# EAGLE design RP2040_Minimal (EAGLE 9.6.2)
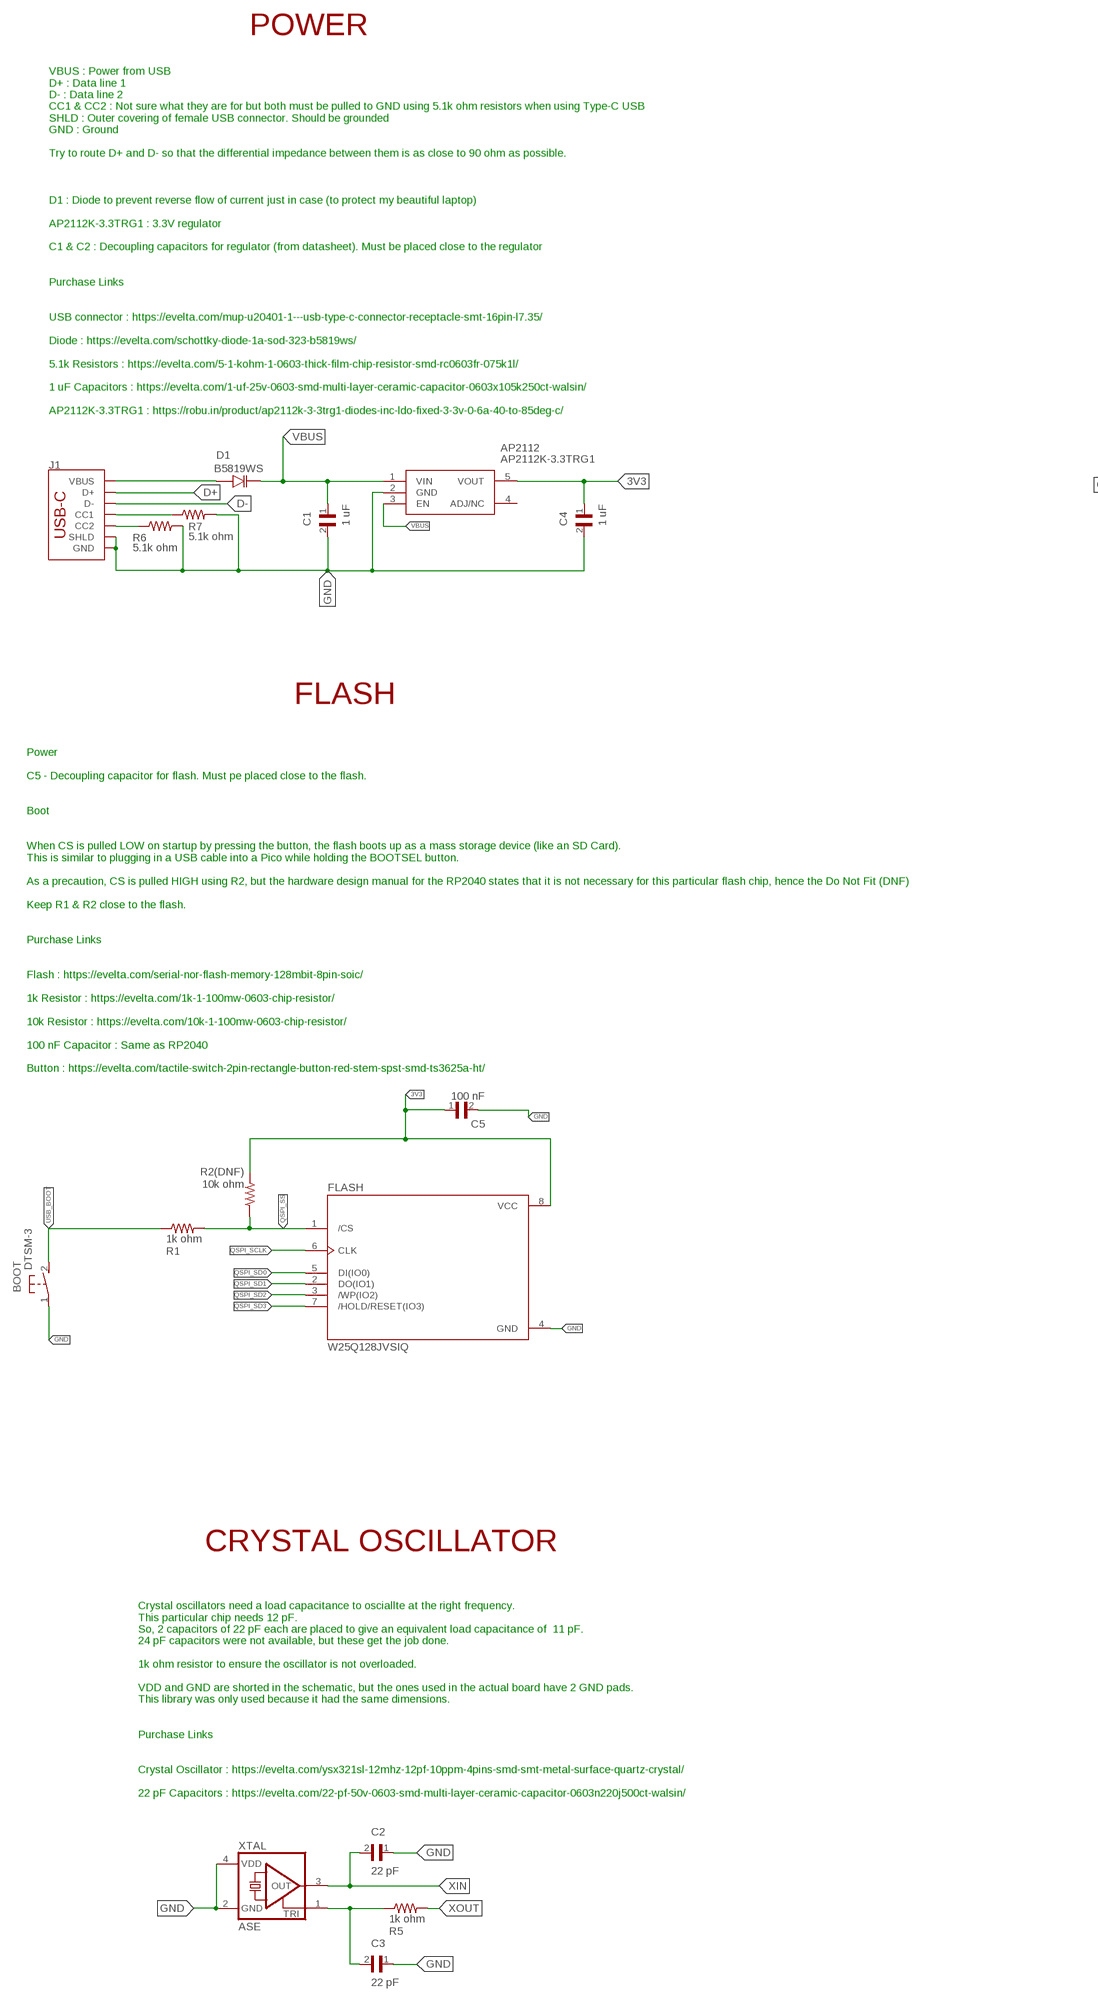
[diagram p0: schematic, sheet 1, part 1 of 2]
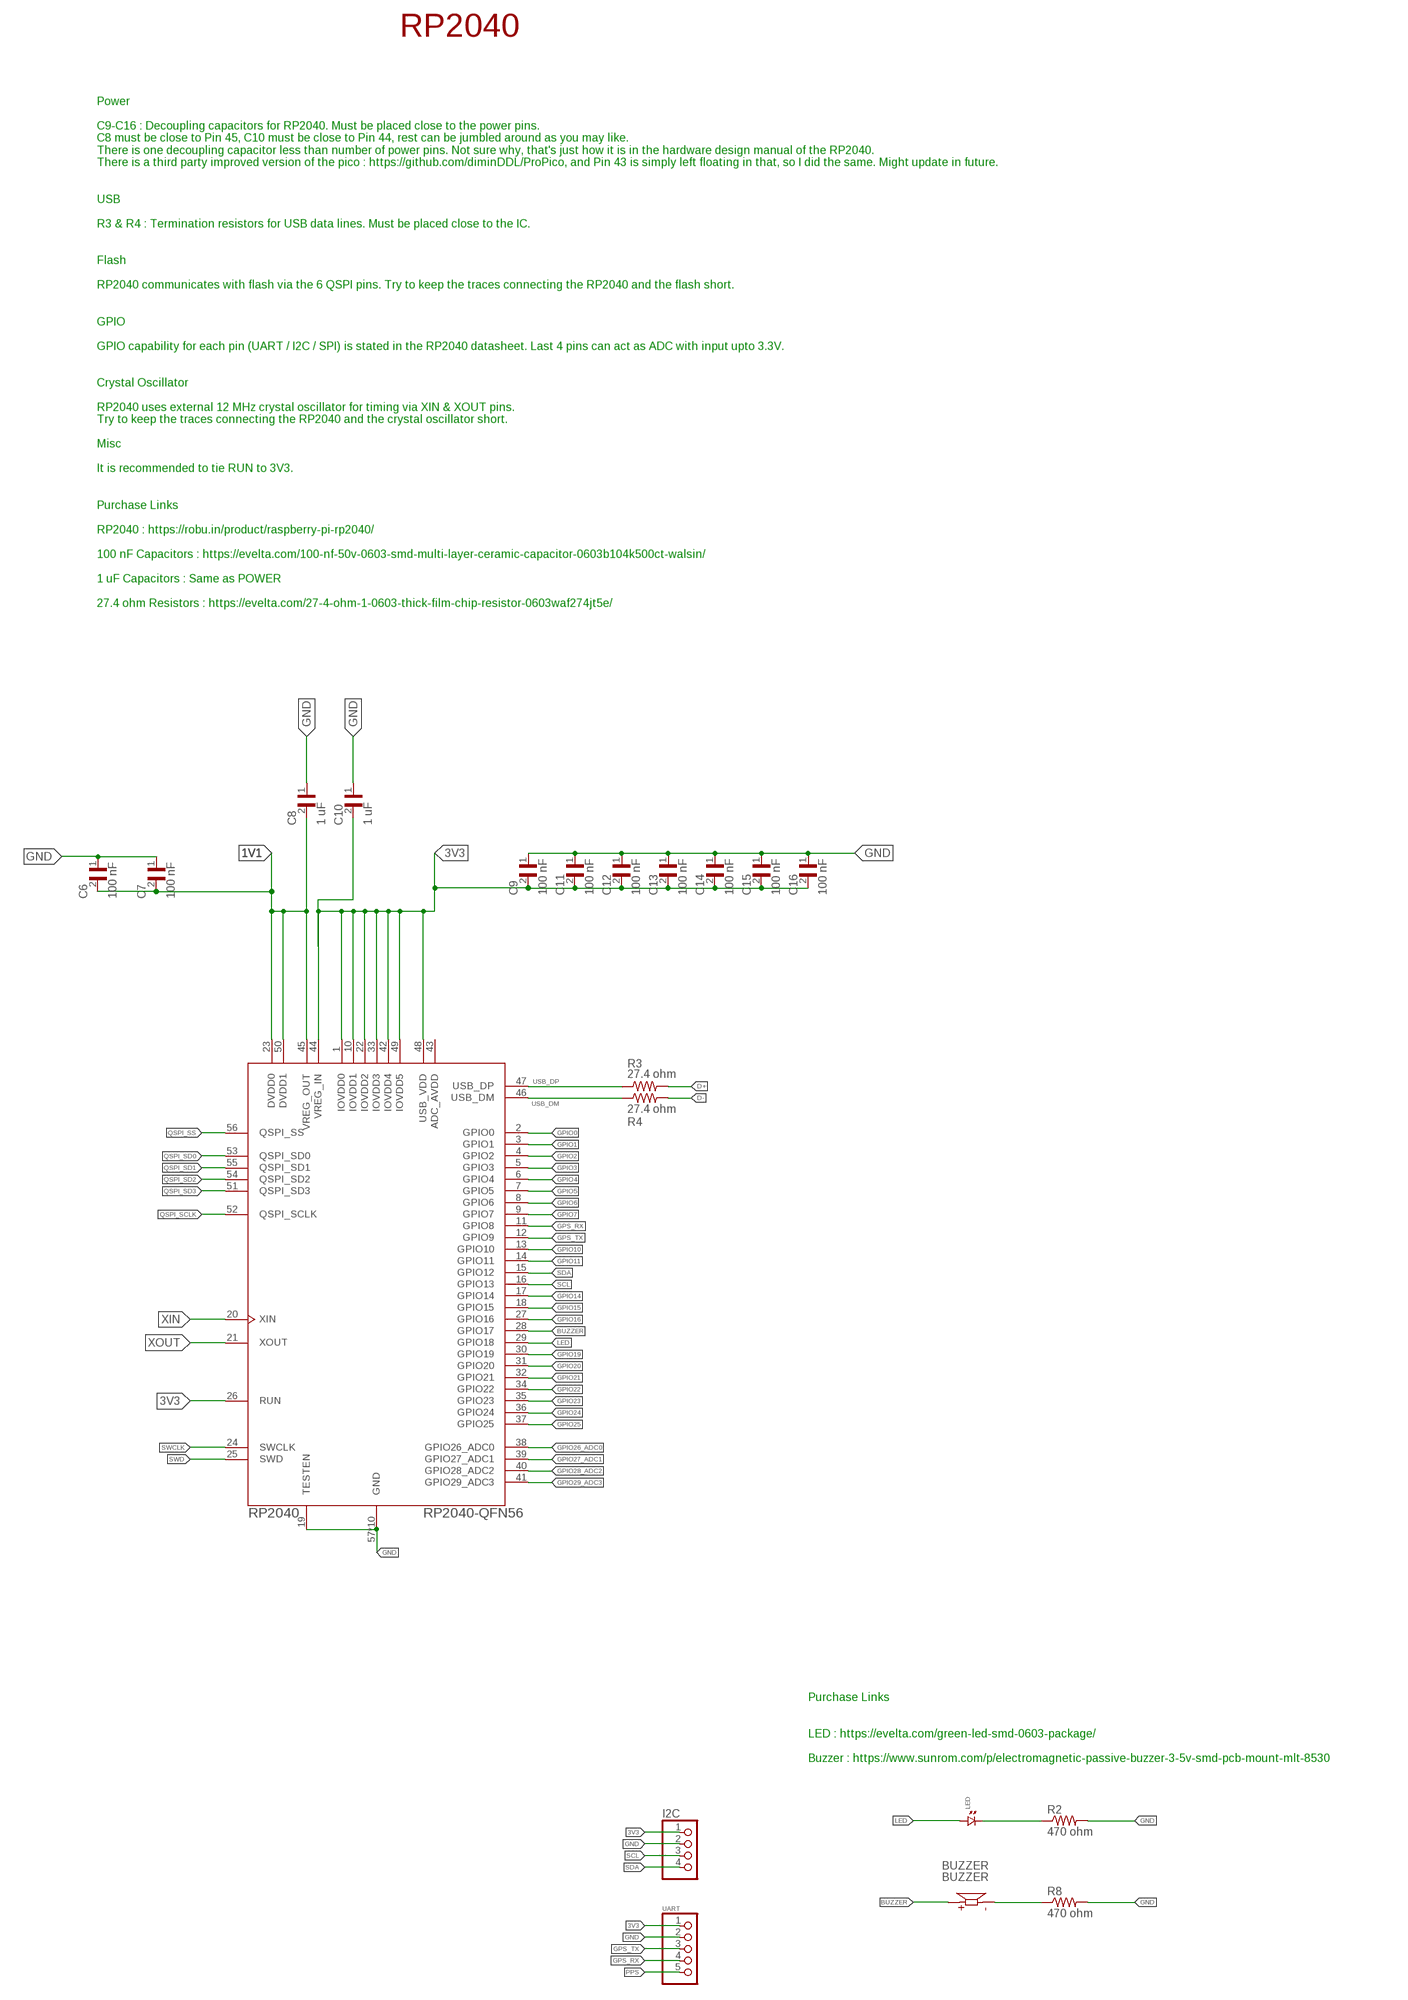
[diagram p1: schematic, sheet 1, part 2 of 2]

## Parts
AP2112  AP2112K-3.3TRG1  [SOT95P282X130-5N]
BOOT  DTSM-3  [DTSM-3]
BUZZER  BUZZER  CMT-8530S-SMT  [CUI_CMT-8530S-SMT]
C1  1 uF  CC0603KRX7R9BB104  [CAPC1608X90]
C2  22 pF  CC0603KRX7R9BB104  [CAPC1608X90]
C3  22 pF  CC0603KRX7R9BB104  [CAPC1608X90]
C4  1 uF  CC0603KRX7R9BB104  [CAPC1608X90]
C5  100 nF  CC0603KRX7R9BB104  [CAPC1608X90]
C6  100 nF  CC0603KRX7R9BB104  [CAPC1608X90]
C7  100 nF  CC0603KRX7R9BB104  [CAPC1608X90]
C8  1 uF  CC0603KRX7R9BB104  [CAPC1608X90]
C9  100 nF  CC0603KRX7R9BB104  [CAPC1608X90]
C10  1 uF  CC0603KRX7R9BB104  [CAPC1608X90]
C11  100 nF  CC0603KRX7R9BB104  [CAPC1608X90]
C12  100 nF  CC0603KRX7R9BB104  [CAPC1608X90]
C13  100 nF  CC0603KRX7R9BB104  [CAPC1608X90]
C14  100 nF  CC0603KRX7R9BB104  [CAPC1608X90]
C15  100 nF  CC0603KRX7R9BB104  [CAPC1608X90]
C16  100 nF  CC0603KRX7R9BB104  [CAPC1608X90]
D1  B5819WS  ZMV829BTA  [SOD2512X116N]
FLASH  W25Q128JVSIQ  [SOIC127P790X216-8N]
I2C  PINHD-1X4  [1X04]
J1  USB_C_2-LAYER_PADS  [USB-C-16P-2LAYER-PADS]
LED  LED.0603  [0603.LED]
R1  1k ohm  CPF0603F49K9C1  [RESC1608X50N]
R2  470 ohm  CPF0603F49K9C1  [RESC1608X50N]
R2(DNF)  10k ohm  CPF0603F49K9C1  [RESC1608X50N]
R3  27.4 ohm  CPF0603F49K9C1  [RESC1608X50N]
R4  27.4 ohm  CPF0603F49K9C1  [RESC1608X50N]
R5  1k ohm  CPF0603F49K9C1  [RESC1608X50N]
R6  5.1k ohm  CPF0603F49K9C1  [RESC1608X50N]
R7  5.1k ohm  CPF0603F49K9C1  [RESC1608X50N]
R8  470 ohm  CPF0603F49K9C1  [RESC1608X50N]
RP2040  RP2040-QFN56  [RP2040-QFN-56]
UART  PINHD-1X5  [1X05]
XTAL  ASE  [ASE]

## Nets
1V1: C6.2 C7.2 C8.2 RP2040.23(DVDD0) RP2040.45(VREG_OUT) RP2040.50(DVDD1)
3V3: AP2112.5(VOUT) C4.1 C5.1 C9.2 C10.2 C11.2 C12.2 C13.2 C14.2 C15.2 C16.2 FLASH.8(VCC) I2C.1 R2(DNF).2 RP2040.1(IOVDD0) RP2040.10(IOVDD1) RP2040.22(IOVDD2) RP2040.26(RUN) RP2040.33(IOVDD3) RP2040.42(IOVDD4) RP2040.44(VREG_IN) RP2040.48(USB_VDD) RP2040.49(IOVDD5) UART.1
BUZZER: BUZZER.P RP2040.28(GPIO17)
D+: J1.A6(D+) J1.B6(D+) R3.2
D-: J1.A7(D-) J1.B7(D-) R4.2
GND: AP2112.2(GND) BOOT.1 C1.2 C2.1 C3.1 C4.2 C5.2 C6.1 C7.1 C8.1 C9.1 C10.1 C11.1 C12.1 C13.1 C14.1 C15.1 C16.1 FLASH.4(GND) I2C.2 J1.GND J1.GND2(GND) J1.SHLD1(SHLD) J1.SHLD2(SHLD) J1.SHLD3(SHLD) J1.SHLD4(SHLD) R2.2 R6.2 R7.2 R8.2 RP2040.19(TESTEN) RP2040.57(GND) RP2040.58(GND) RP2040.59(GND) RP2040.60(GND) RP2040.61(GND) RP2040.62(GND) RP2040.63(GND) RP2040.64(GND) RP2040.65(GND) RP2040.66(GND) UART.2 XTAL.2(GND) XTAL.4(VDD)
GPIO0: RP2040.2(GPIO0)
GPIO1: RP2040.3(GPIO1)
GPIO2: RP2040.4(GPIO2)
GPIO3: RP2040.5(GPIO3)
GPIO4: RP2040.6(GPIO4)
GPIO5: RP2040.7(GPIO5)
GPIO6: RP2040.8(GPIO6)
GPIO7: RP2040.9(GPIO7)
GPIO10: RP2040.13(GPIO10)
GPIO11: RP2040.14(GPIO11)
GPIO14: RP2040.17(GPIO14)
GPIO15: RP2040.18(GPIO15)
GPIO16: RP2040.27(GPIO16)
GPIO19: RP2040.30(GPIO19)
GPIO20: RP2040.31(GPIO20)
GPIO21: RP2040.32(GPIO21)
GPIO22: RP2040.34(GPIO22)
GPIO23: RP2040.35(GPIO23)
GPIO24: RP2040.36(GPIO24)
GPIO25: RP2040.37(GPIO25)
GPIO26_ADC0: RP2040.38(GPIO26_ADC0)
GPIO27_ADC1: RP2040.39(GPIO27_ADC1)
GPIO28_ADC2: RP2040.40(GPIO28_ADC2)
GPIO29_ADC3: RP2040.41(GPIO29_ADC3)
GPS_RX: RP2040.11(GPIO8) UART.4
GPS_TX: RP2040.12(GPIO9) UART.3
LED: LED.P$1 RP2040.29(GPIO18)
N$1: D1.A J1.VBUS1(VBUS) J1.VBUS2(VBUS)
N$2: LED.P$2 R2.1
N$3: C3.2 R5.1 XTAL.1(TRI)
N$4: J1.B5(CC2) R6.1
N$5: J1.A5(CC1) R7.1
N$6: BUZZER.N R8.1
PPS: UART.5
QSPI_SCLK: FLASH.6(CLK) RP2040.52(QSPI_SCLK)
QSPI_SD0: FLASH.5(DI(IO0)) RP2040.53(QSPI_SD0)
QSPI_SD1: FLASH.2(DO(IO1)) RP2040.55(QSPI_SD1)
QSPI_SD2: FLASH.3(/WP(IO2)) RP2040.54(QSPI_SD2)
QSPI_SD3: FLASH.7(/HOLD/RESET(IO3)) RP2040.51(QSPI_SD3)
QSPI_SS: FLASH.1(/CS) R1.2 R2(DNF).1 RP2040.56(QSPI_SS)
SCL: I2C.3 RP2040.16(GPIO13)
SDA: I2C.4 RP2040.15(GPIO12)
SWCLK: RP2040.24(SWCLK)
SWD: RP2040.25(SWD)
USB_BOOT: BOOT.2 R1.1
USB_DM: R4.1 RP2040.46(USB_DM)
USB_DP: R3.1 RP2040.47(USB_DP)
VBUS: AP2112.1(VIN) AP2112.3(EN) C1.1 D1.K
XIN: C2.2 RP2040.20(XIN) XTAL.3(OUT)
XOUT: R5.2 RP2040.21(XOUT)
Unconnected: AP2112.4(ADJ/NC)

## Notes on the sheet
- RP2040
- POWER
- Power
  
  C9-C16 : Decoupling capacitors for RP2040. Must be placed close to the power pins.
  C8 must be close to Pin 45, C10 must be close to Pin 44, rest can be jumbled around as you may like.
  There is one decoupling capacitor less than number of power pins. Not sure why, that's just how it is in the hardware design manual of the RP2040.
  There is a third party improved version of the pico : https://github.com/diminDDL/ProPico, and Pin 43 is simply left floating in that, so I did the same. Might update in future.
  
  
  USB
  
  R3 & R4 : Termination resistors for USB data lines. Must be placed close to the IC.
  
  
  Flash
  
  RP2040 communicates with flash via the 6 QSPI pins. Try to keep the traces connecting the RP2040 and the flash short.
  
  
  GPIO
  
  GPIO capability for each pin (UART / I2C / SPI) is stated in the RP2040 datasheet. Last 4 pins can act as ADC with input upto 3.3V.
  
  
  Crystal Oscillator
  
  RP2040 uses external 12 MHz crystal oscillator for timing via XIN & XOUT pins.
  Try to keep the traces connecting the RP2040 and the crystal oscillator short.
  
  Misc
  
  It is recommended to tie RUN to 3V3.
  
  
  Purchase Links
  
  RP2040 : https://robu.in/product/raspberry-pi-rp2040/
  
  100 nF Capacitors : https://evelta.com/100-nf-50v-0603-smd-multi-layer-ceramic-capacitor-0603b104k500ct-walsin/
  
  1 uF Capacitors : Same as POWER
  
  27.4 ohm Resistors : https://evelta.com/27-4-ohm-1-0603-thick-film-chip-resistor-0603waf274jt5e/
- VBUS : Power from USB
  D+ : Data line 1
  D- : Data line 2
  CC1 & CC2 : Not sure what they are for but both must be pulled to GND using 5.1k ohm resistors when using Type-C USB
  SHLD : Outer covering of female USB connector. Should be grounded
  GND : Ground
  
  Try to route D+ and D- so that the differential impedance between them is as close to 90 ohm as possible.
  
  
  
  D1 : Diode to prevent reverse flow of current just in case (to protect my beautiful laptop)
  
  AP2112K-3.3TRG1 : 3.3V regulator
  
  C1 & C2 : Decoupling capacitors for regulator (from datasheet). Must be placed close to the regulator
  
  
  Purchase Links
  
  
  USB connector : https://evelta.com/mup-u20401-1---usb-type-c-connector-receptacle-smt-16pin-l7.35/
  
  Diode : https://evelta.com/schottky-diode-1a-sod-323-b5819ws/
  
  5.1k Resistors : https://evelta.com/5-1-kohm-1-0603-thick-film-chip-resistor-smd-rc0603fr-075k1l/
  
  1 uF Capacitors : https://evelta.com/1-uf-25v-0603-smd-multi-layer-ceramic-capacitor-0603x105k250ct-walsin/
  
  AP2112K-3.3TRG1 : https://robu.in/product/ap2112k-3-3trg1-diodes-inc-ldo-fixed-3-3v-0-6a-40-to-85deg-c/
- FLASH
- Power
  
  C5 - Decoupling capacitor for flash. Must pe placed close to the flash.
  
  
  Boot
  
  
  When CS is pulled LOW on startup by pressing the button, the flash boots up as a mass storage device (like an SD Card). 
  This is similar to plugging in a USB cable into a Pico while holding the BOOTSEL button.
  
  As a precaution, CS is pulled HIGH using R2, but the hardware design manual for the RP2040 states that it is not necessary for this particular flash chip, hence the Do Not Fit (DNF)
  
  Keep R1 & R2 close to the flash.
  
  
  Purchase Links
  
  
  Flash : https://evelta.com/serial-nor-flash-memory-128mbit-8pin-soic/
  
  1k Resistor : https://evelta.com/1k-1-100mw-0603-chip-resistor/
  
  10k Resistor : https://evelta.com/10k-1-100mw-0603-chip-resistor/
  
  100 nF Capacitor : Same as RP2040
  
  Button : https://evelta.com/tactile-switch-2pin-rectangle-button-red-stem-spst-smd-ts3625a-ht/
- Purchase Links
  
  
  LED : https://evelta.com/green-led-smd-0603-package/
  
  Buzzer : https://www.sunrom.com/p/electromagnetic-passive-buzzer-3-5v-smd-pcb-mount-mlt-8530
- CRYSTAL OSCILLATOR
- Crystal oscillators need a load capacitance to osciallte at the right frequency.
  This particular chip needs 12 pF.
  So, 2 capacitors of 22 pF each are placed to give an equivalent load capacitance of  11 pF. 
  24 pF capacitors were not available, but these get the job done.
  
  1k ohm resistor to ensure the oscillator is not overloaded.
  
  VDD and GND are shorted in the schematic, but the ones used in the actual board have 2 GND pads.
  This library was only used because it had the same dimensions.
  
  
  Purchase Links
  
  
  Crystal Oscillator : https://evelta.com/ysx321sl-12mhz-12pf-10ppm-4pins-smd-smt-metal-surface-quartz-crystal/
  
  22 pF Capacitors : https://evelta.com/22-pf-50v-0603-smd-multi-layer-ceramic-capacitor-0603n220j500ct-walsin/

## Power pins joined to a net without a drawn wire
ADC_AVDD: RP2040.43(ADC_AVDD)

## Library data of the parts
AP2112 = AP2112K-3.3TRG1:AP2112K-3.3TRG1: 600mA 3.3V LDO Regulator Enable SOT23-5 DiodesZetex AP2112K-3.3TRG1, LDO Voltage Regulator, 3.3 V +/-1.5%, 2.5 6 Vin, 5-Pin SOT-23 Source: Datasheet <http://uk.rs-online.com/web/p/products/8283509>; ARROW_PART_NUMBER: AP2112K-3.3TRG1; ARROW_PRICE-STOCK: https://www.arrow.com/en/products/ap2112k-3.3trg1/diodes-incorporated; DESCRIPTION: 600mA 3.3V LDO Regulator Enable SOT23-5 DiodesZetex AP2112K-3.3TRG1, LDO Voltage Regulator, 3.3 V +/-1.5%, 2.5 6 Vin, 5-Pin SOT-23; HEIGHT: 1.3mm; MANUFACTURER_NAME: Diodes Inc.; MANUFACTURER_PART_NUMBER: AP2112K-3.3TRG1; MOUSER_PART_NUMBER: 621-AP2112K-3.3TRG1; MOUSER_PRICE-STOCK: https://www.mouser.co.uk/ProductDetail/Diodes-Incorporated/AP2112K-33TRG1?qs=x6A8l6qLYDDPYHosCdzh%2FA%3D%3D
BOOT = switch-tact:DTSM-3
BUZZER = CMT-8530S-SMT:CMT-8530S-SMT: 8.5 mm, 3.6 Vo-p, 90 dB, Surface Mount (SMT), Magnetic Audio Transducer Buzzer Check availability <https://pricing.snapeda.com/parts/CMT-8530S-SMT-TR/CUI%20Devices/view-part?ref=eda>; AVAILABILITY: In Stock; CHECK_PRICES: https://www.snapeda.com/parts/CMT-8530S-SMT-TR/CUI+Devices/view-part/?ref=eda; CUI_PURCHASE_URL: https://www.cuidevices.com/product/audio/buzzers/audio-transducers/cmt-8530s-smt-tr?utm_source=snapeda.com&utm_medium=referral&utm_campaign=snapedaBOM; DESCRIPTION: 8.5 mm, 3.6 Vo-p, 90 dB, Surface Mount (SMT), Magnetic Audio Transducer Buzzer; MF: CUI Devices; MP: CMT-8530S-SMT-TR; PACKAGE: None; PRICE: None; PURCHASE-URL: https://www.snapeda.com/api/url_track_click_mouser/?unipart_id=649163&manufacturer=CUI Devices&part_name=CMT-8530S-SMT-TR&search_term=None; SNAPEDA_LINK: https://www.snapeda.com/parts/CMT-8530S-SMT-TR/CUI+Devices/view-part/?ref=snap
C1-C16 = CC0603KRX7R9BB104:CC0603KRX7R9BB104: CAPACITOR, 0603, 100NF, 50V, X7R; Dielectric Characteristic:X7R; Capacitance:100000pF; Capacitance Tolerance:± 10%; Voltage Rating:50V; Temperature Coefficient:± 15%; Capacitor Case Style:0603; No. of Pins:2; Mounting Type:SMD; Operating Temperature Range:-55°C to +125°C; SVHC:No SVHC; Application:Standard; Capacitor Dielectric Type:Multilayer Ceramic; Case Style:0603; Max Operating Temperature:125°C; Min Temperature Operating:-55°C; Terminal Type:Surface Mount (SMD, SMT); Termination Type:SMD; Tolerance, +:10%; Tolerance, -:10%; Voltage Rating DC:50V Check availability <https://pricing.snapeda.com/parts/CC0603KRX7R9BB104/Yageo/view-part?ref=eda>; AVAILABILITY: In Stock; CHECK_PRICES: https://www.snapeda.com/parts/CC0603KRX7R9BB104/Yageo/view-part/?ref=eda; DESCRIPTION: 0.1 µF ±10% 50V Ceramic Capacitor X7R 0603 (1608 Metric); MF: Yageo; MP: CC0603KRX7R9BB104; PACKAGE: 0603 Yageo; PRICE: None; SNAPEDA_LINK: https://www.snapeda.com/parts/CC0603KRX7R9BB104/Yageo/view-part/?ref=snap
D1 = ZMV829BTA:ZMV829BTA: Varactors Single 25V Surface Mount SOD-323 Check availability <https://pricing.snapeda.com/parts/ZMV829BTA/Diodes%20Inc./view-part?ref=eda>; AVAILABILITY: In Stock; CHECK_PRICES: https://www.snapeda.com/parts/ZMV829BTA/Diodes+Inc./view-part/?ref=eda; DESCRIPTION: Varactors Single 25 V Surface Mount SOD-323; MF: Diodes Inc.; MP: ZMV829BTA; PACKAGE: SOD-323 Diodes Inc.; PRICE: None; SNAPEDA_LINK: https://www.snapeda.com/parts/ZMV829BTA/Diodes+Inc./view-part/?ref=snap
FLASH = W25Q128JVSIQ:W25Q128JVSIQ: Check availability <https://pricing.snapeda.com/parts/W25Q128JVSIQ/Winbond%20Electronics/view-part?ref=eda>; AVAILABILITY: In Stock; CHECK_PRICES: https://www.snapeda.com/parts/W25Q128JVSIQ/Winbond+Electronics/view-part/?ref=eda; DESCRIPTION: FLASH - NOR Memory IC 128Mb (16M x 8) SPI - Quad I/O, QPI, DTR 133 MHz 8-SOIC; MF: Winbond Electronics; MP: W25Q128JVSIQ; PACKAGE: SOIC-8 Winbond Electronics; PRICE: None; SNAPEDA_LINK: https://www.snapeda.com/parts/W25Q128JVSIQ/Winbond+Electronics/view-part/?ref=snap
I2C = pinhead:PINHD-1X4: PIN HEADER
J1 = SparkFun-Connectors:USB_C: USB Type C 16Pin Connector Super Speed pins not available on the 16-pin purely SMD connector so this part is best for USB 2.0 implementations. D1 and D2 are tied together enabling D+/- no matter which way the cable is plugged into the connector. The two channel configuration pins (CC1/2) are exposed. These are normally connected to ground via 5.1k resistors but can be reconfigured for high current/high power applications. **4-LAYER BOARD WARNING!!** If designing 4-layer board, make sure to select the variant _4-LAYER-ISOLATED. The linked footprint (USB-C-16-4LAYER-ISOLATED) includes some very necessary cutout polygons in the inner layers (2 and 15). This prevents the PTH mounting shield legs on the USB connector from electrically connecting any other polygons on the inner layers (usually VCC and GND).; PROD_ID: CONN-14122
LED = standardparts:LED
R1 R2 R2(DNF) R3-R8 = CPF0603F49K9C1:CPF0603F49K9C1: CPF 0603 49K9 1% 50PPM 1K RL Check availability <https://pricing.snapeda.com/parts/CPF0603F49K9C1/TE%20Connectivity/view-part?ref=eda>; AVAILABILITY: In Stock; CHECK_PRICES: https://www.snapeda.com/parts/CPF0603F49K9C1/TE+Connectivity/view-part/?ref=eda; COMMENT: 2-1879338-7; DESCRIPTION: Surface Mount Thin Film Resistor, Cpf Series, 49.9 Kohm, 63 Mw, - 1%, 50 V, 0603 [1608 Metric]; EU_ROHS_COMPLIANCE: Compliant; MF: TE Connectivity; MP: CPF0603F49K9C1; PACKAGE: 0603; POWER_RATING: .063 W; PRICE: None; PURCHASE-URL: https://www.snapeda.com/api/url_track_click_mouser/?unipart_id=952882&manufacturer=TE Connectivity&part_name=CPF0603F49K9C1&search_term=None; RESISTANCE: 49.9K; SNAPEDA_LINK: https://www.snapeda.com/parts/CPF0603F49K9C1/TE+Connectivity/view-part/?ref=snap; TOLERANCE: 1%; VOLTAGE_RATING: 50 V
RP2040 = RpiPico:RP2040-QFN56
UART = pinhead:PINHD-1X5: PIN HEADER
XTAL = crystal:ASE: 3.3Vdc CMOS SMD CRYSTAL CLOCK OSCILLATOR SOurce: www.abracon.com; OC_FARNELL: unknown; OC_NEWARK: unknown

## Board
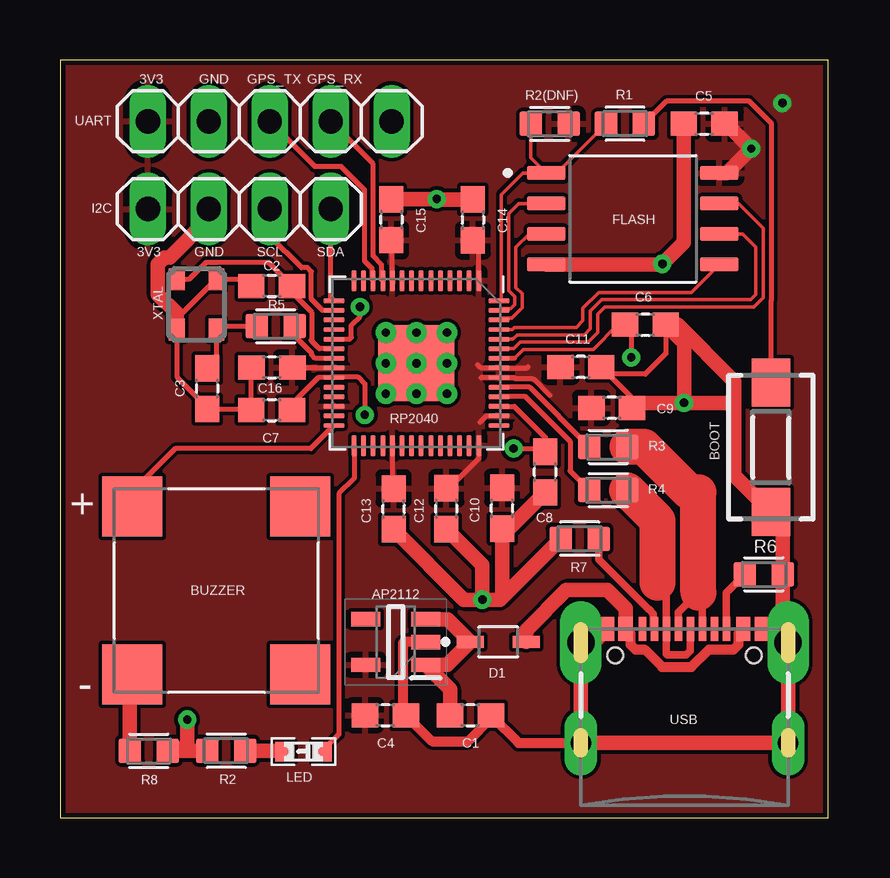
[diagram p2: board, top side]
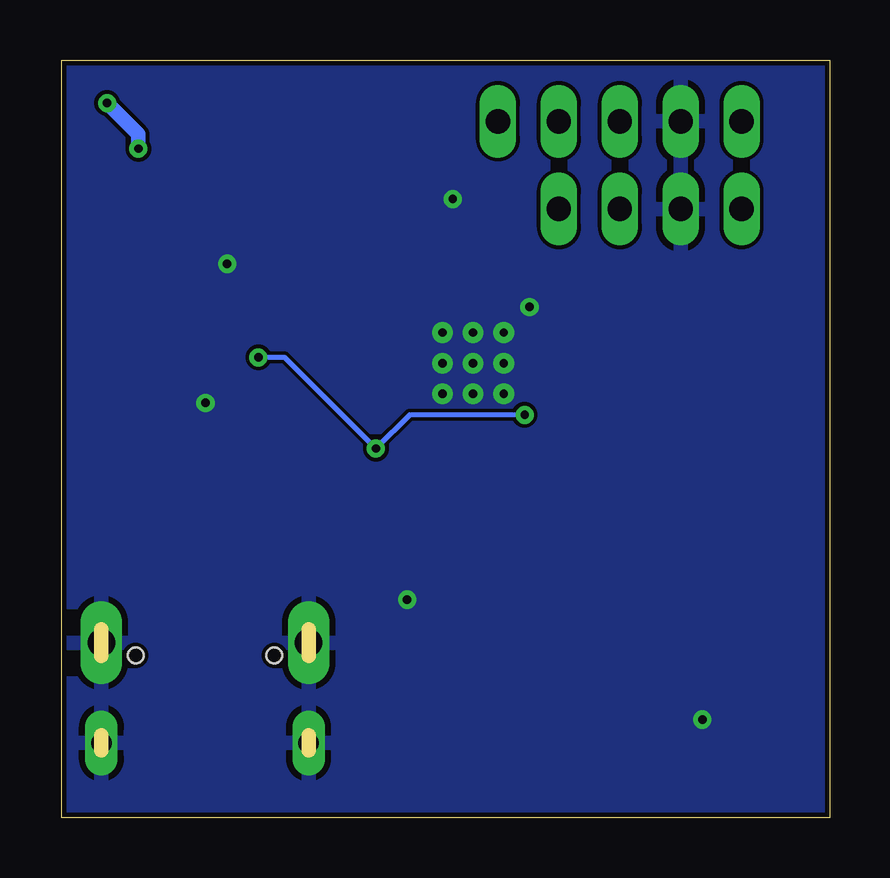
[diagram p3: board, bottom side, seen from below]

Size 32 x 31.6 mm. Coordinates in mm from the lower left corner, seen from the top.
Outline: 0,0 32,0 32,31.6 0,31.6 0,0
Copper layers (1*16): Top 0.035mm / dielectric 1.5mm / Bottom 0.035mm
Design rules "default *": minimum track width 6mil, minimum drill 0.35mm, track to track 6mil, track to pad 6mil, pad to pad 6mil, via to via 6mil, smd to smd 6mil, copper to edge 8mil, drill to drill 6mil, minimum pad ring 10mil, minimum via ring 8mil, stop-mask expansion 4mil, vias tented up to drill 0mil, thermal gap 10mil

### Footprints (pad centres in the part's own frame; a part is rotated, then mirrored left to right if it is on the bottom)
SOT95P282X130-5N = smd 1.2 x 0.6: 1 -1.25,0.95; 2 -1.25,0; 3 -1.25,-0.95; 4 1.25,-0.95; 5 1.25,0.95
DTSM-3 = smd 2 x 1.6: 1 -2.7,0; 2 2.7,0
CUI_CMT-8530S-SMT = smd 2.5 x 2.5: 1 -3.5,3.5; 2 -3.5,-3.5; N 3.5,3.5; P 3.5,-3.5
CAPC1608X90 = smd 1.1 x 1: 1 -0.85,0; 2 0.85,0
SOD2512X116N = smd 1.11 x 0.52: A 1.165,0; K -1.165,0
SOIC127P790X216-8N = smd 1.61 x 0.58: 1 -3.605,1.905; 2 -3.605,0.635; 3 -3.605,-0.635; 4 -3.605,-1.905; 5 3.605,-1.905; 6 3.605,-0.635; 7 3.605,0.635; 8 3.605,1.905
1X04 = drill 1.016 long: 1 -3.81,0; 2 -1.27,0; 3 1.27,0; 4 3.81,0
USB-C-16P-2LAYER-PADS = smd 0.3 x 1: A5 -1.25,-0.34; A6 -0.25,-0.34; A7 0.25,-0.34; A8 1.25,-0.34; B5 1.75,-0.34; B6 0.75,-0.34; B7 -0.75,-0.34; B8 -1.75,-0.34 | smd 0.6 x 1: GND -3.225,-0.34; GND2 3.225,-0.34; VBUS1 -2.45,-0.34; VBUS2 2.45,-0.34 | drill 1.15 pad 1.27 long: SHLD1 -4.318,-0.915; SHLD2 4.318,-0.915 | drill 0.85 pad 1.016 long: SHLD3 -4.318,-5.095; SHLD4 4.318,-5.095 | hole 0.65: -2.89,-1.445; 2.89,-1.445
0603.LED = smd 0.8 x 0.8: P$1 -0.775,0; P$2 0.775,0
RESC1608X50N = smd 0.94 x 1.02: 1 -0.79,0; 2 0.79,0
RP2040-QFN-56 = smd 0.875 x 0.2: 1 -3.438,2.6; 2 -3.438,2.2; 3 -3.438,1.8; 4 -3.438,1.4; 5 -3.438,1; 6 -3.438,0.6; 7 -3.438,0.2; 8 -3.438,-0.2; 9 -3.438,-0.6; 10 -3.438,-1; 11 -3.438,-1.4; 12 -3.438,-1.8; 13 -3.438,-2.2; 14 -3.438,-2.6; 29 3.438,-2.6; 30 3.438,-2.2; 31 3.438,-1.8; 32 3.438,-1.4; 33 3.438,-1; 34 3.438,-0.6; 35 3.438,-0.2; 36 3.438,0.2; 37 3.438,0.6; 38 3.438,1; 39 3.438,1.4; 40 3.438,1.8; 41 3.438,2.2; 42 3.438,2.6 | smd 0.2 x 0.875: 15 -2.6,-3.438; 16 -2.2,-3.438; 17 -1.8,-3.438; 18 -1.4,-3.438; 19 -1,-3.438; 20 -0.6,-3.438; 21 -0.2,-3.438; 22 0.2,-3.438; 23 0.6,-3.438; 24 1,-3.438; 25 1.4,-3.438; 26 1.8,-3.438; 27 2.2,-3.438; 28 2.6,-3.438; 43 2.6,3.438; 44 2.2,3.438; 45 1.8,3.438; 46 1.4,3.438; 47 1,3.438; 48 0.6,3.438; 49 0.2,3.438; 50 -0.2,3.438; 51 -0.6,3.438; 52 -1,3.438; 53 -1.4,3.438; 54 -1.8,3.438; 55 -2.2,3.438; 56 -2.6,3.438 | smd 3.2 x 3.2: 57 0,0 | drill 0.35 pad 0.6: 58 -1.275,1.275; 59 0,1.275; 60 1.275,1.275; 61 -1.275,0; 62 0,0; 63 1.275,0; 64 -1.275,-1.275; 65 0,-1.275; 66 1.275,-1.275
1X05 = drill 1.016 long: 1 -5.08,0; 2 -2.54,0; 3 0,0; 4 2.54,0; 5 5.08,0
ASE = smd 0.9 x 0.65: 1 -1.05,-0.825; 2 1.05,-0.825; 3 1.05,0.825; 4 -1.05,0.825

### Placement (x,y rotation side)
AP2112  13.99,7.33 180 top
BOOT  29.62,15.46 90 top
BUZZER  6.52,9.48 180 top
C1  17.1,4.28 0 top
C2  8.82,22.18 0 top
C3  6.14,17.9 90 top
C4  13.56,4.28 0 top
C5  26.84,28.94 180 top
C6  24.39,20.56 180 top
C7  8.82,17 0 top
C8  20.22,14.42 90 top
C9  22.99,17.1 180 top
C10  18.42,12.91 90 top
C11  21.7,18.8 180 top
C12  16.1,12.89 90 top
C13  13.9,12.88 90 top
C14  17.2,24.93 270 top
C15  13.8,24.94 270 top
C16  8.83,18.78 0 top
D1  18.26,7.34 0 top
FLASH  23.87,24.98 0 top
I2C  7.47,25.39 0 top
J1  26.02,8.22 0 top
LED  10.14,2.77 180 top
R1  23.54,28.94 180 top
R2  6.92,2.8 180 top
R2(DNF)  20.41,28.94 0 top
R3  22.85,15.47 0 top
R4  22.84,13.67 0 top
R5  8.99,20.5 0 top
R6  29.33,10.16 0 top
R7  21.65,11.64 180 top
R8  3.7,2.8 0 top
RP2040  14.85,18.96 270 top
UART  8.74,29.04 0 top
XTAL  5.69,21.41 90 top

### Tracks (layer width: path | path; a pad name or v marks a point on that pad's centre or on a via)
1V1  (via drill 0.35)
  Top 0.152: 18.94,19.16 19.3,19.53 22.21,19.53 23.24,20.56 C6.2
  Top 0.203: RP2040.45 18.93,17.16 20.22,15.87 20.22,15.4 | 20.22,15.4 C8.2 | C7.2 9.67,17.27 10.76,18.36 RP2040.23 11.45,18.4 12.4,18.4 12.7,18.1 v12.7,16.8 | C6.2 23.8,20.3 v23.8,19.2 | v18.9,15.4 20.22,15.4 | 18.94,19.16 RP2040.50
  Bottom 0.203: v23.8,19.2 22.7,19.2 v18.9,15.4 17.5,16.8 v12.7,16.8
3V3  (via drill 0.35)
  Top 0.203: RP2040.42 17.45,14.99 16.2,13.74 C12.2 | RP2040.33 13.85,13.78 C13.2 | RP2040.1 17.45,23.83 C14.2 | RP2040.10 13.85,24.04 C15.2 | RP2040.22 9.7,18.76 C16.2 | RP2040.44 17.76,16.76 17.5,16.5 | 17.54,18.36 RP2040.48 18.94,18.36 18.98,18.32 19.72,18.32 20.42,17.62 | 17.4,18.9 17.54,18.76 RP2040.49 19.46,18.76 19.5,18.8
  Top 0.61: C5.1 27.76,28.94 v28.8,27.9 27.79,26.88 FLASH.8
  Bottom 0.61: v28.8,27.9 28.8,28.5 v30.1,29.8
  pour Top: -6.3,31.4 -2.9,28 -2.9,-2.7 34.3,-2.7 34.3,35.7 32.8,37.2 -0.5,37.2
BUZZER
  Top 0.203: RP2040.28 10.45,15.4 4.8,15.4 3.02,13.62 BUZZER.P
D+
  Top 0.305: J1.A6 25.77,8.57 26.6,9.4 26.77,9.23 J1.B6
  Top 1.5: 26.6,9.4 26.6,13.57 26.24,13.57 24.34,15.47 R3.2
D-
  Top 0.305: J1.A7 26.27,6.97 26.1,6.8 25.3,6.8 25.27,6.83 J1.B7 25.27,9.43 24.9,9.8
  Top 1.5: 24.9,9.8 24.9,12.4 R4.2
GND  (via drill 0.35)
  Top 0.203: C2.1 7.69,22.46 XTAL.2 4.87,20.81 XTAL.4 4.87,18.38 6.2,17.05 | C3.1 6.2,17.05 | 6.2,17.05 7.92,17.05 C7.1 C16.1 | RP2040.19 12.06,19.96 12.14,20.04 12.14,20.55 12.5,20.9 v12.5,21.3 | C6.1 25.24,19.35 24.39,18.51 22.84,18.51 C11.1 23.84,17.51 C9.1
  Top 0.406: AP2112.2 14.33,7.33 14.28,7.28 14.28,4.41 C4.2 15.49,3.2 17,3.2 17.95,4.15 C1.2 19.11,3.12 J1.SHLD3
  Top 0.61: J1.GND 22.22,7.31 J1.SHLD1 J1.SHLD3 J1.SHLD4 J1.SHLD2 | J1.GND2 29.76,7.88 J1.SHLD2 | R8.2 5,2.8 | 5,2.8 R2.2 | FLASH.4 25.07,23.07 v25.1,23.1 25.99,23.99 C5.2 | 28.1,17.3 28.1,18.2 25.74,20.56 C6.1 26,19.8 v26,17.3 | 28.1,17.3 28.1,14.28 BOOT.1 30.12,12.26 R6.2 30.12,7.52 J1.SHLD2 | C13.1 16.83,9.1 v17.6,9.1 | C12.1 17.6,10.54 v17.6,9.1 | R7.2 18.42,9.2 | 18.42,9.2 18.32,9.1 v17.6,9.1 | C8.1 18.71,12.06 C10.1 18.42,9.2 | C15.1 v15.7,25.8 15.72,25.78 C14.1 | 5,2.8 5.3,3.1 v5.3,4.1 | XTAL.4 4.87,21.04 4.08,21.82 4.08,23.1 4.35,23.37 4.57,23.37 6.2,25 I2C.2 | C9.1 24.04,17.3 v26,17.3 | v26,17.3 28.1,17.3
  pour Bottom: -4.2,33.3 -4.2,-0.3 1.5,-6 35.4,-6 39.7,-1.7 39.7,28.6 35.1,33.2 34.1,34.2 -1.7,34.2 -3.4,34.2 -4.2,33.4
GPS_RX
  Top 0.203: UART.4 13.05,27.27 13.05,23.43 13.41,23.07 13.41,22.44 RP2040.11
GPS_TX
  Top 0.203: UART.3 10.61,27.17 11.7,27.17 12.69,26.18 12.69,23.22 13,22.91 13,22.44 RP2040.12
LED
  Top 0.203: RP2040.29 12.25,14.15 11.62,13.52 11.62,3.48 LED.P$1
N$1
  Top 0.406: J1.VBUS1 23.76,7.69 23.76,7.23 23.97,7.02 24.36,7.02 25.09,6.29 26.31,6.29 27.04,7.02 28.07,7.02 28.28,7.24 28.28,7.69 J1.VBUS2
  Top 0.61: J1.VBUS1 23.57,8.73 22.8,9.5 21.1,9.5 19.43,7.83 D1.A
N$2
  Top 0.61: R2.1 9.34,2.8 LED.P$2
N$3
  Top 0.203: C3.2 6.51,19.12 XTAL.1 6.66,20.5 R5.1
N$4
  Top 0.305: J1.B5 27.77,9.39 R6.1
N$5
  Top 0.305: J1.A5 24.73,7.92 24.73,8.51 24.55,8.68 24.52,8.68 22.44,10.77 R7.1
N$6
  Top 0.61: R8.1 2.91,5.87 BUZZER.N
QSPI_SCLK
  Top 0.152: RP2040.52 18.88,19.96 19.05,20.14 21.83,20.14 22.1,20.4 22.1,21.13 22.57,21.61 28.77,21.61 29,21.83 29,23.8 28.45,24.34 FLASH.6
QSPI_SD0
  Top 0.152: RP2040.53 18.84,20.36 18.93,20.44 21.5,20.44 21.79,20.73 21.79,21.25 22.45,21.91 26.31,21.91 FLASH.5
QSPI_SD1
  Top 0.152: RP2040.55 18.36,21.23 18.79,21.23 18.95,21.39 18.95,21.72 18.69,21.99 18.69,25.2 19.11,25.61 FLASH.2
QSPI_SD2
  Top 0.152: RP2040.54 18.36,20.83 18.82,20.83 19.26,21.27 19.26,21.85 19,22.11 19,23.8 19.54,24.34 FLASH.3
QSPI_SD3
  Top 0.152: RP2040.51 18.91,19.56 19.18,19.83 22,19.83 22.4,20.23 22.4,21 22.7,21.3 28.9,21.3 29.3,21.7 29.3,24.6 28.29,25.61 FLASH.7
QSPI_SS
  Top 0.152: RP2040.56 18.39,21.66 18.39,25.99 19.29,26.88 FLASH.1 | R2(DNF).1 19.62,27.53 FLASH.1 | R1.2 20.7,26.88 FLASH.1
SCL
  Top 0.203: RP2040.16 10.95,21.16 10.47,21.63 10.47,22.79 10.33,22.93 10.07,22.93 8.74,24.26 I2C.3
SDA
  Top 0.203: RP2040.15 11.28,21.69 I2C.4
USB_BOOT
  Top 0.203: R1.1 25.29,29.9 28.7,29.9 29.63,28.97 29.63,21.56 29.62,21.55 BOOT.2
USB_DM
  Top 0.203: RP2040.46 19.39,17.56 21.25,15.7 21.25,14.47 R4.1
USB_DP
  Top 0.203: R3.1 19.57,17.96 RP2040.47
VBUS
  Top 0.61: AP2112.3 16.16,8.28 D1.K 16.14,6.38 AP2112.1 16.25,5.37 C1.1
XIN
  Top 0.203: RP2040.20 10.81,19.56 10.47,19.9 10.5,19.94 10.5,21.06 9.67,21.89 C2.2 8.69,23.16 6.08,23.16 5.38,22.46 XTAL.3
XOUT
  Top 0.203: RP2040.21 10.64,19.16 10.48,19.32 10.48,19.38 9.78,20.09 R5.2

### Text on the board
tNames: 3V3 | GND | GPS_TX | GPS_RX | 3V3 | GND | SCL | SDA | USB